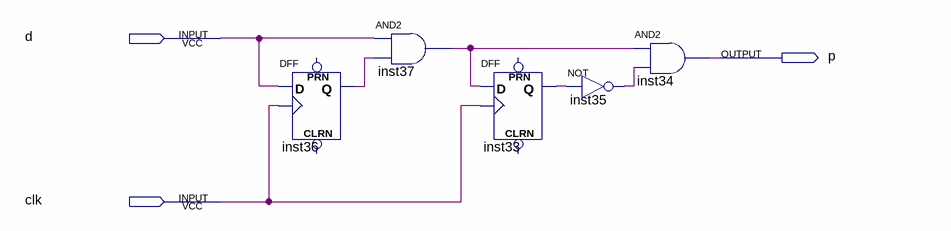
[diagram p0: schematic sheet]
// Quartus schematic pai.bdf as structural Verilog: 5 symbols, 3 pins
module pai (
  input  d,
  input  clk,
  output p
);

  wire inst33_q, inst35_out, inst36_q, inst37_out;

  DFF inst36 (.CLK(clk), .D(d), .Q(inst36_q));  // open: CLRN, PRN
  and inst37 (inst37_out, d, inst36_q);
  DFF inst33 (.CLK(clk), .D(inst37_out), .Q(inst33_q));  // open: CLRN, PRN
  not inst35 (inst35_out, inst33_q);
  and inst34 (p, inst37_out, inst35_out);
endmodule
